# EAGLE design cable-adapter-12 (EAGLE 6.5.0)
DESIGNER: JONNEW, MWL@MIT; DESIGN_NAME: Cable adapter 24; LICENSE: (C) Jon Newman CC BY-SA-NC 4.0
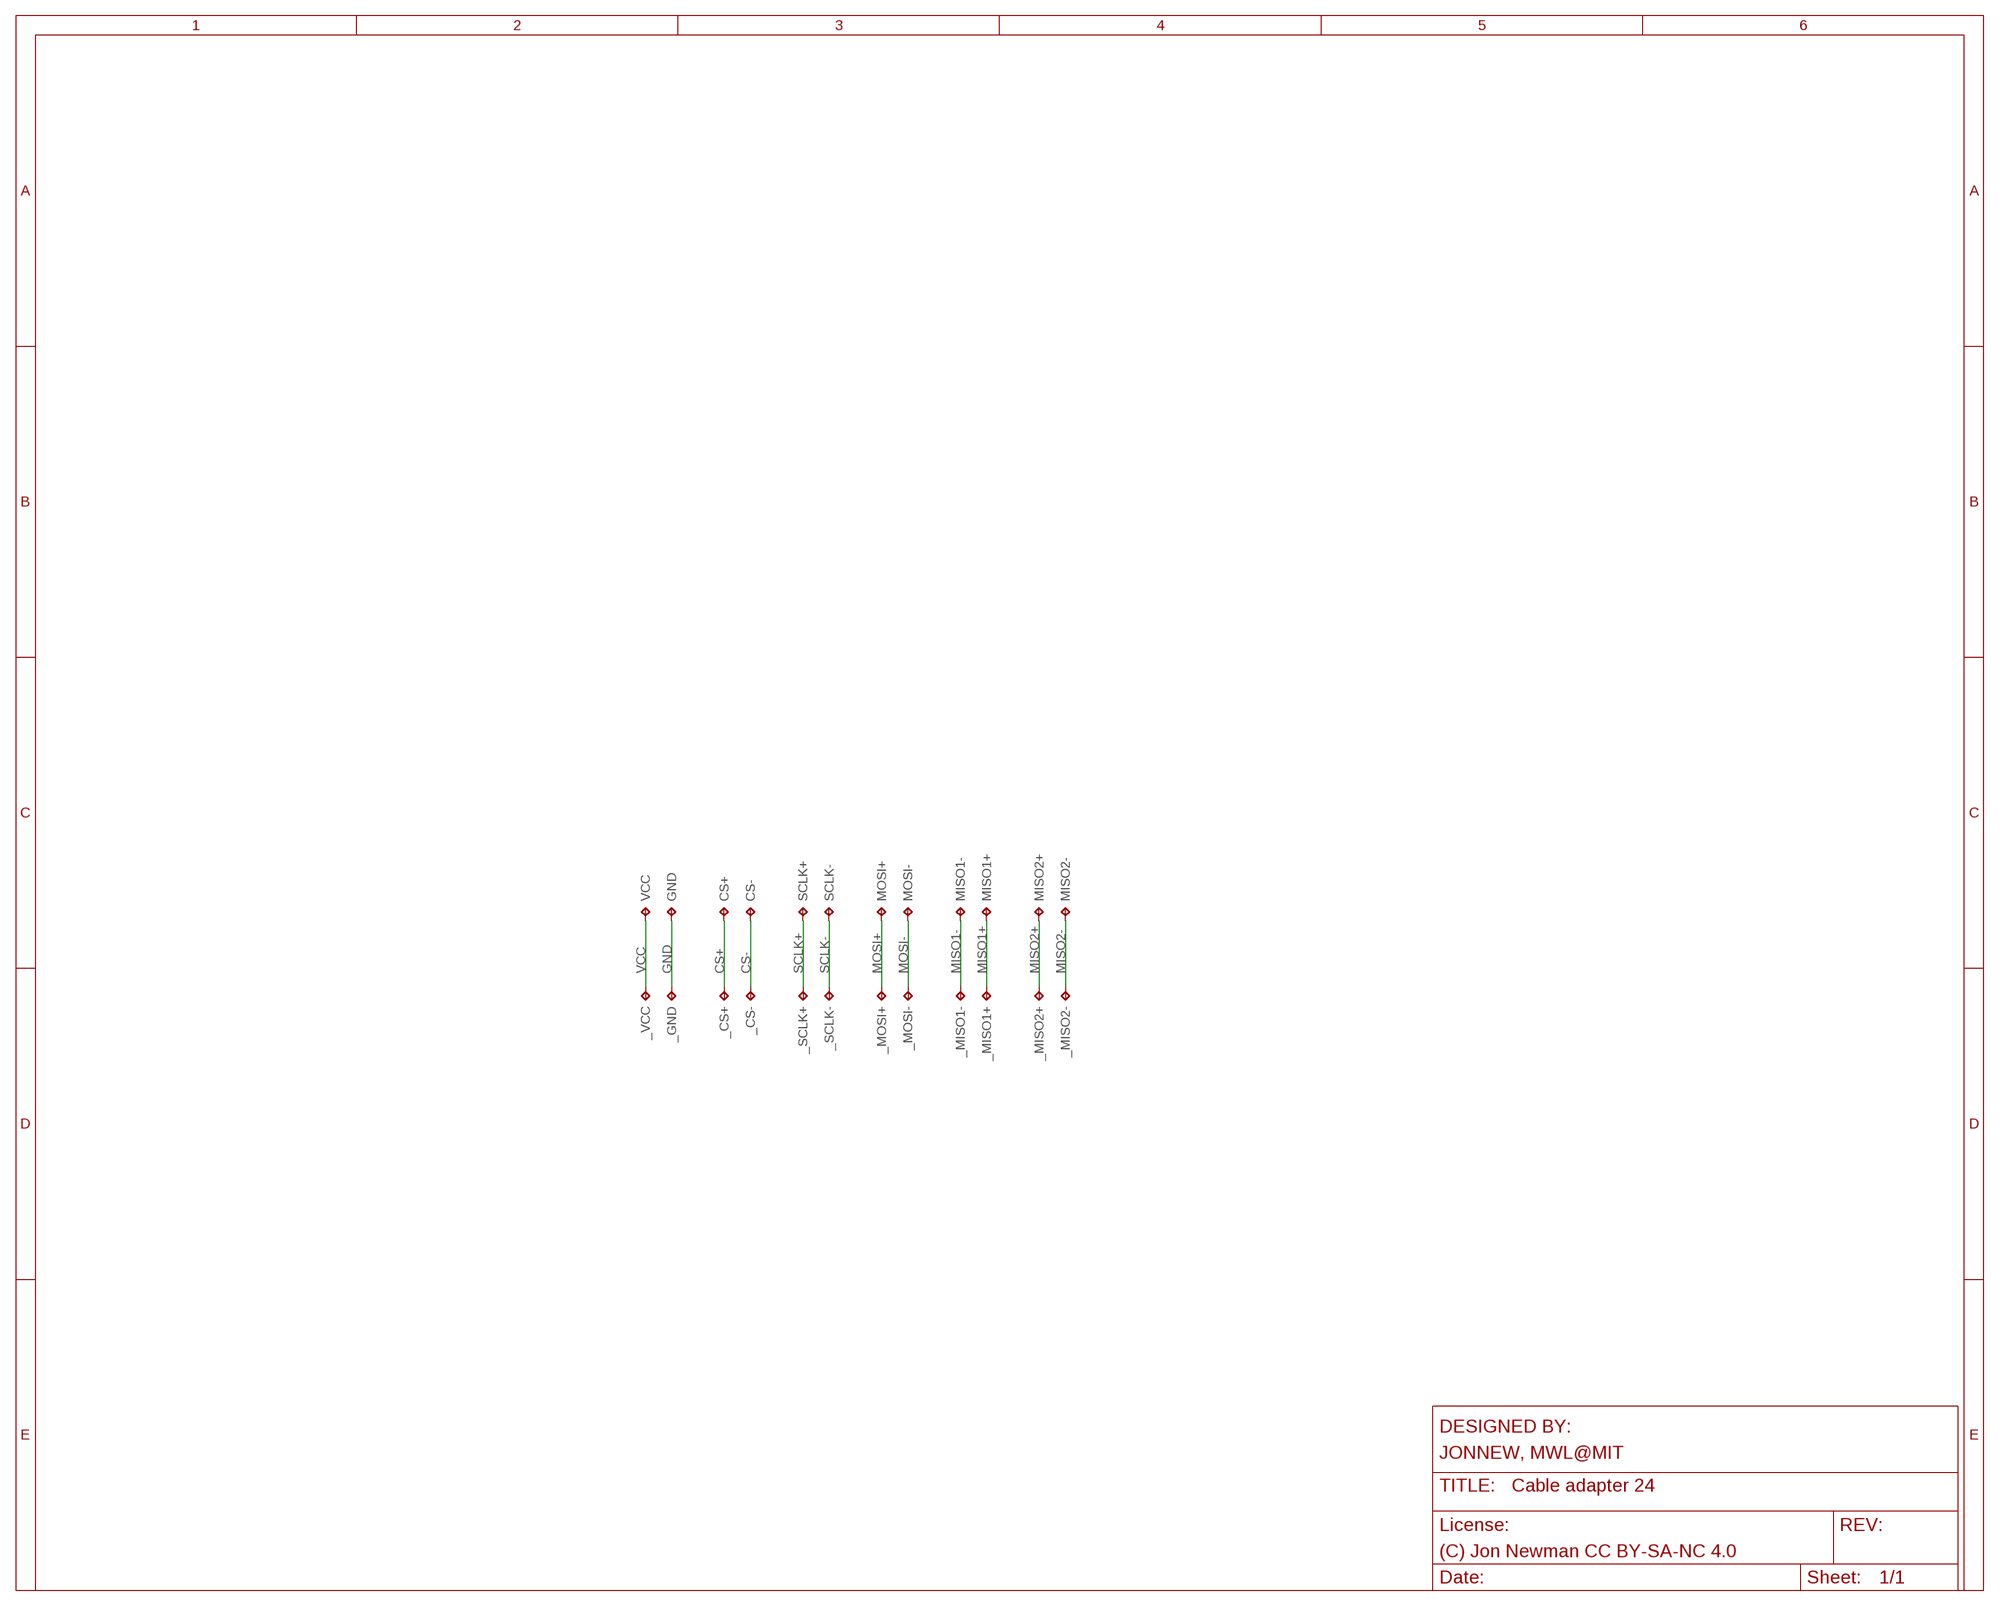
[diagram p0: schematic, sheet 1]

## Parts
_CS+  TP_SPI_WIRE+  [SPI_WIRE+]
_CS-  TP_SPI_WIRE+  [SPI_WIRE+]
_GND  TP_SPI_WIRE+  [SPI_WIRE+]
_MISO1+  TP_SPI_WIRE+  [SPI_WIRE+]
_MISO1-  TP_SPI_WIRE+  [SPI_WIRE+]
_MISO2+  TP_SPI_WIRE+  [SPI_WIRE+]
_MISO2-  TP_SPI_WIRE+  [SPI_WIRE+]
_MOSI+  TP_SPI_WIRE+  [SPI_WIRE+]
_MOSI-  TP_SPI_WIRE+  [SPI_WIRE+]
_SCLK+  TP_SPI_WIRE+  [SPI_WIRE+]
_SCLK-  TP_SPI_WIRE+  [SPI_WIRE+]
_VCC  TP_SPI_WIRE+  [SPI_WIRE+]
CS+  TP_SPI_WIRE+  [SPI_WIRE+]
CS-  TP_SPI_WIRE+  [SPI_WIRE+]
GND  TP_SPI_WIRE+  [SPI_WIRE+]
MISO1+  TP_SPI_WIRE+  [SPI_WIRE+]
MISO1-  TP_SPI_WIRE+  [SPI_WIRE+]
MISO2+  TP_SPI_WIRE+  [SPI_WIRE+]
MISO2-  TP_SPI_WIRE+  [SPI_WIRE+]
MOSI+  TP_SPI_WIRE+  [SPI_WIRE+]
MOSI-  TP_SPI_WIRE+  [SPI_WIRE+]
SCLK+  TP_SPI_WIRE+  [SPI_WIRE+]
SCLK-  TP_SPI_WIRE+  [SPI_WIRE+]
VCC  TP_SPI_WIRE+  [SPI_WIRE+]

## Nets
CS+: _CS+.P$1(TP) CS+.P$1(TP)
CS-: _CS-.P$1(TP) CS-.P$1(TP)
GND: _GND.P$1(TP) GND.P$1(TP)
MISO1+: _MISO1+.P$1(TP) MISO1+.P$1(TP)
MISO1-: _MISO1-.P$1(TP) MISO1-.P$1(TP)
MISO2+: _MISO2+.P$1(TP) MISO2+.P$1(TP)
MISO2-: _MISO2-.P$1(TP) MISO2-.P$1(TP)
MOSI+: _MOSI+.P$1(TP) MOSI+.P$1(TP)
MOSI-: _MOSI-.P$1(TP) MOSI-.P$1(TP)
SCLK+: _SCLK+.P$1(TP) SCLK+.P$1(TP)
SCLK-: _SCLK-.P$1(TP) SCLK-.P$1(TP)
VCC: _VCC.P$1(TP) VCC.P$1(TP)

## Library data of the parts
_CS+ _CS- _GND _MISO1+ _MISO1- _MISO2+ _MISO2- _MOSI+ _MOSI- _SCLK+ _SCLK- _VCC CS+ CS- GND MISO1+ MISO1- MISO2+ MISO2- MOSI+ MOSI- SCLK+ SCLK- VCC = jonnew:TP: Test pad

## Board
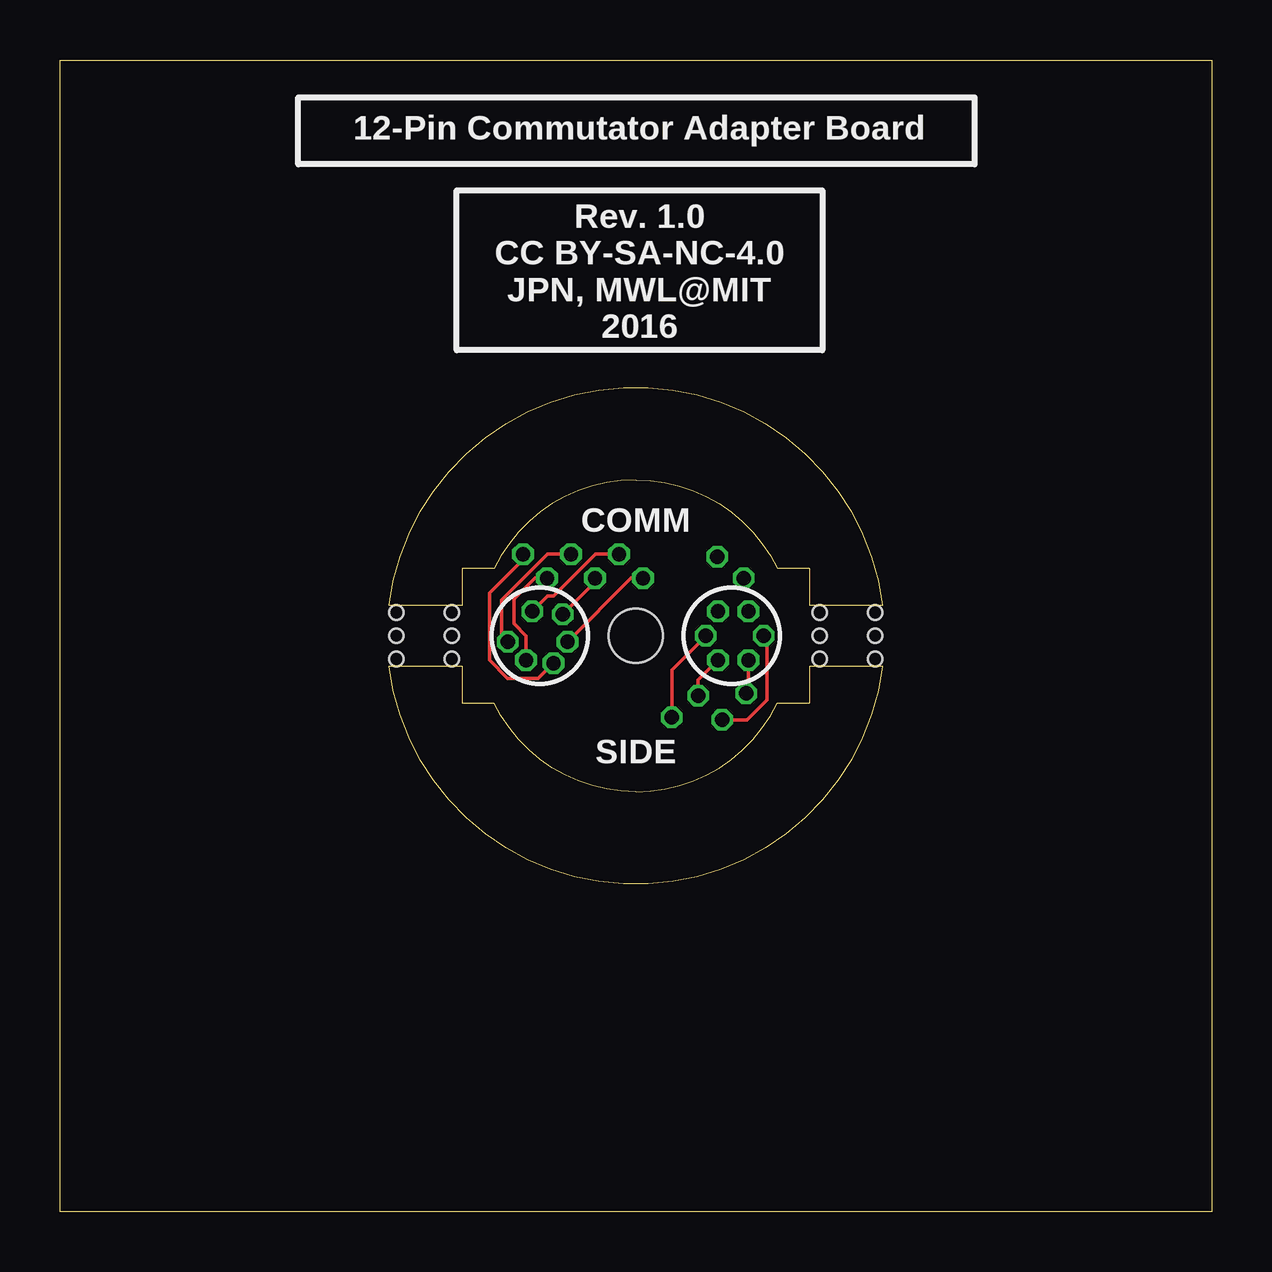
[diagram p1: board, top side]
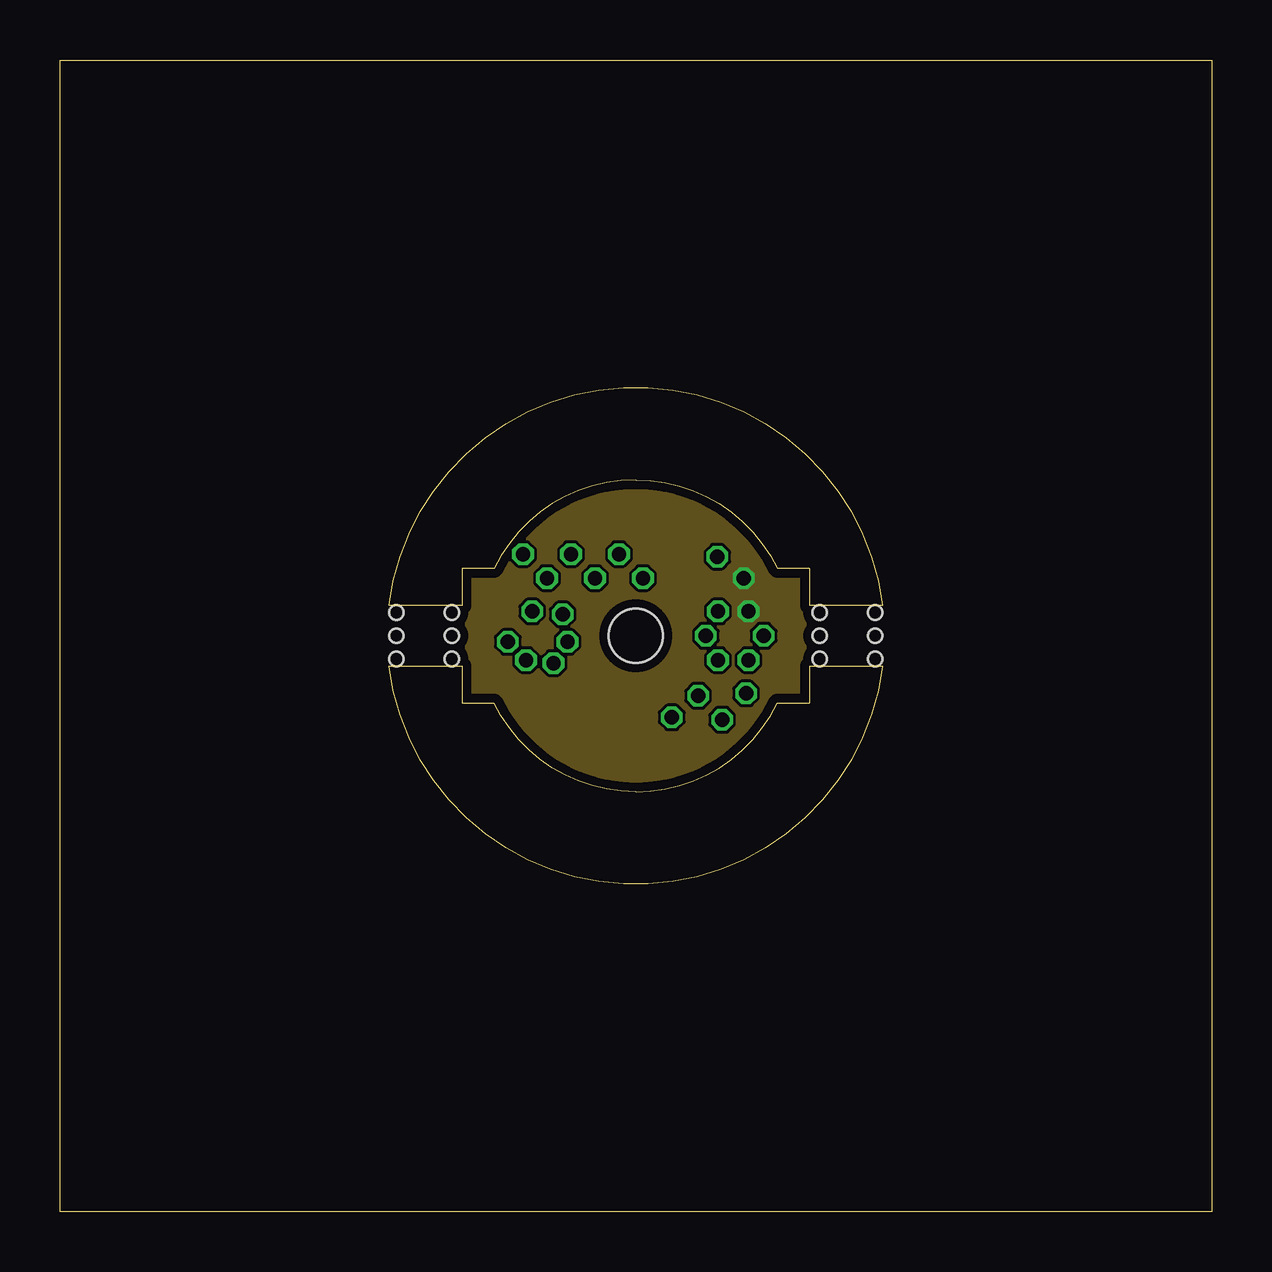
[diagram p2: board, inner layer Route2]
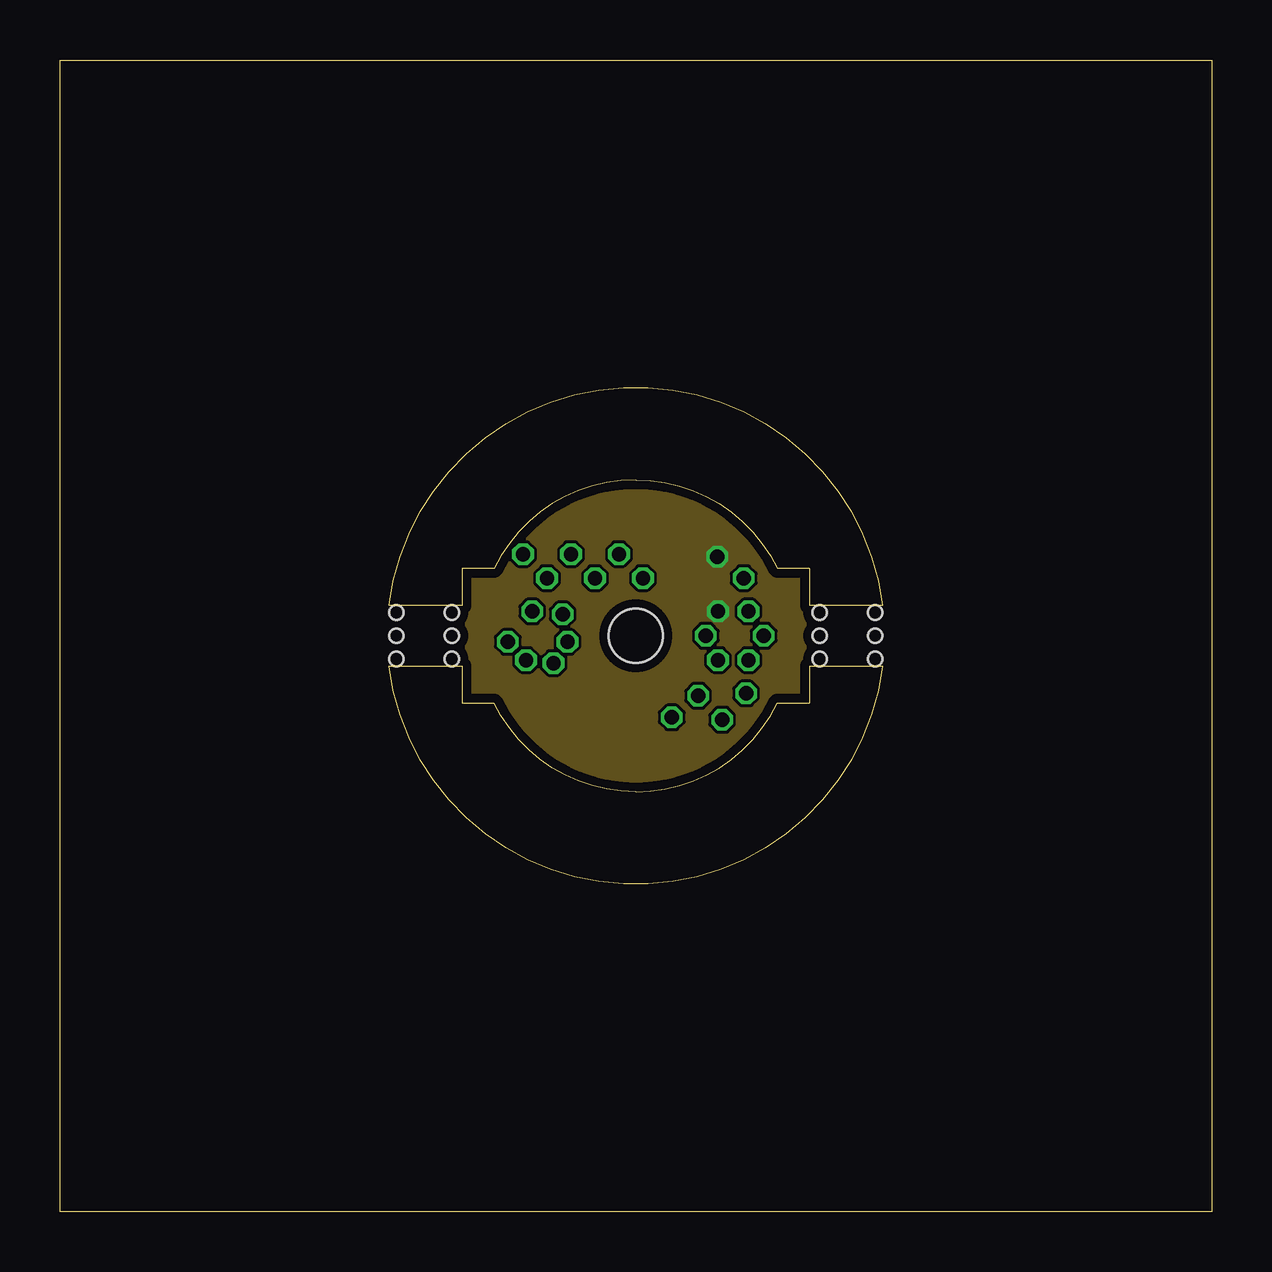
[diagram p3: board, inner layer Route15]
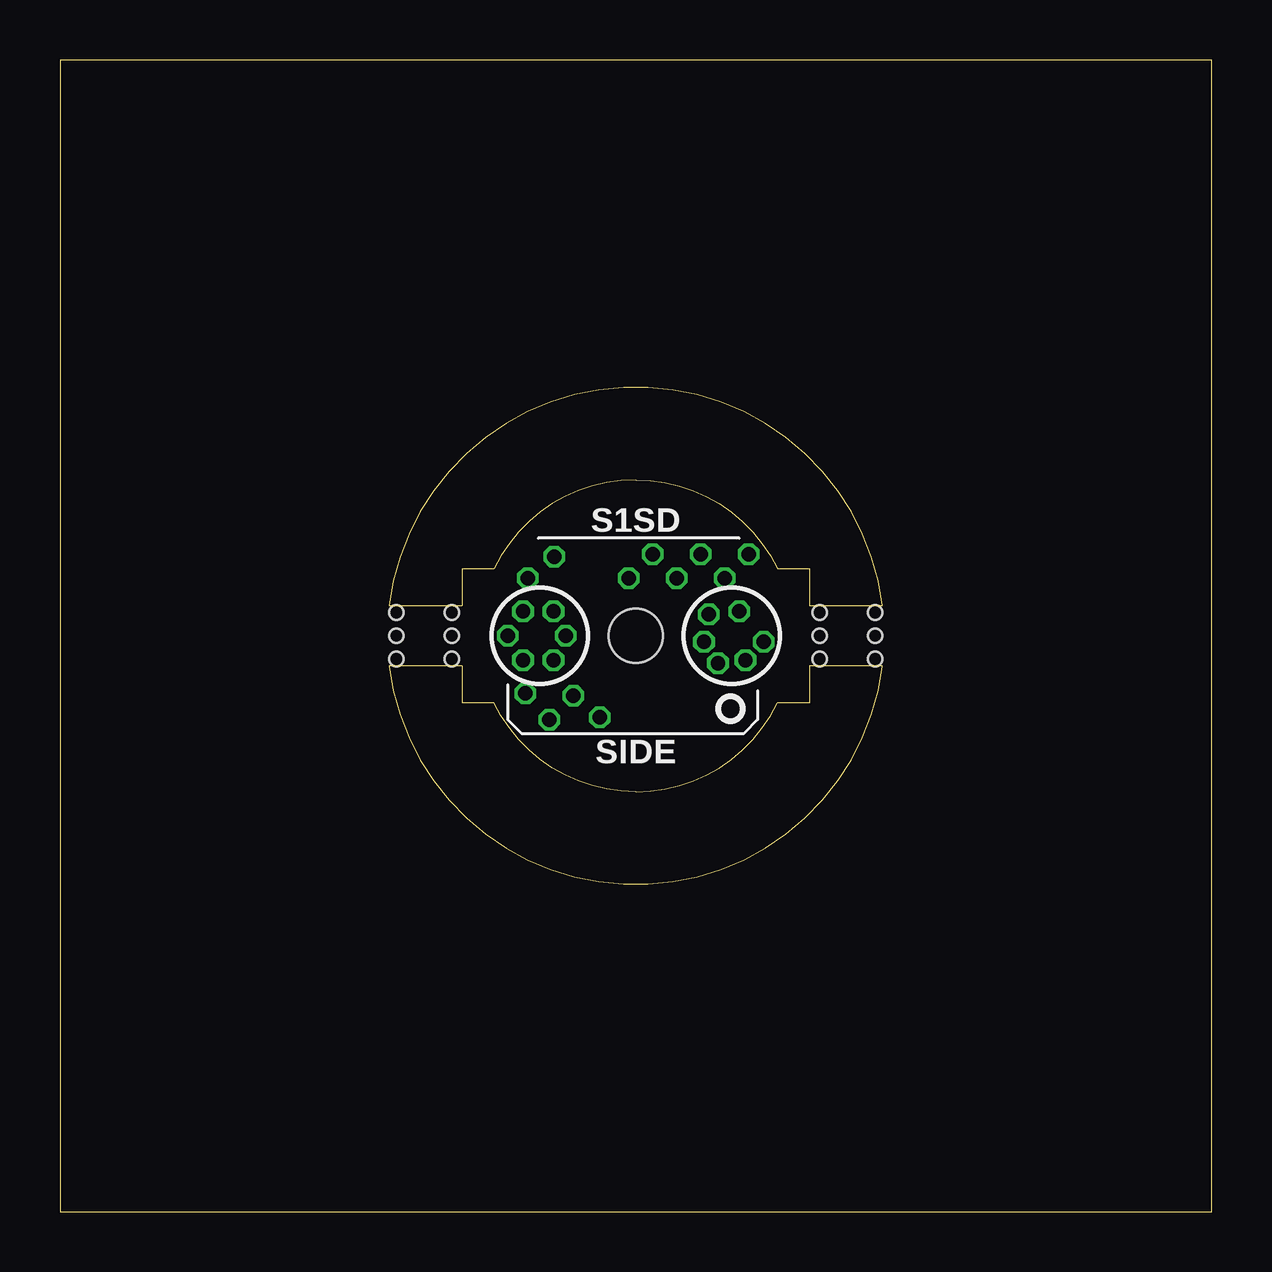
[diagram p4: board, bottom side, seen from below]

Size 48 x 48 mm. Coordinates in mm from the lower left corner, seen from the top.
Outline: 0,0 0,48 48,48 48,0 0,0
Outline: 13.71,22.73 16.76,22.73 16.76,21.21 18.1,21.2 arc65 24,17.5 arc65 29.9,21.2 31.24,21.21 31.24,22.73 34.29,22.73 arc-166 13.71,22.73
Outline: 16.76,25.27 13.71,25.27 arc-166 34.29,25.27 31.24,25.27 31.24,26.79 29.9,26.8 arc65 24,30.5 arc65 18.1,26.8 16.76,26.79 16.76,25.27
Copper layers (1*2*15*16): Top 0.035559375mm / dielectric 0.17018125mm / Route2 0.01778125mm / dielectric 47mil / Route15 0.01778125mm / dielectric 0.17018125mm / Bottom 0.035559375mm
Design rules "ohs-park-4-layer": minimum track width 5mil, minimum drill 10mil, track to track 5mil, track to pad 5mil, pad to pad 5mil, via to via 5mil, smd to smd 5mil, copper to edge 15mil, drill to drill 5mil, minimum pad ring 4mil, minimum via ring 4mil, stop-mask expansion 4mil, vias tented up to drill 100mil, thermal gap 10mil
Holes 2.26 mm at 24,24
Holes 0.6 mm at 16.33,24.97 16.33,24 16.33,23.03 14.02,24.97 14.02,24 14.02,23.03 31.67,23.03 31.67,24 31.67,24.97 33.98,23.03 33.98,24 33.98,24.97

### Footprints (pad centres in the part's own frame; a part is rotated, then mirrored left to right if it is on the bottom)
SPI_WIRE+ = drill 0.6 octagon: P$1 0,0

### Placement (x,y rotation side)
_CS+  20.57,22.86 0 top
_CS-  19.43,22.98 0 top
_GND  28.7,25.02 0 top
_MISO1+  27.43,22.98 0 top
_MISO1-  26.92,24 0 top
_MISO2+  28.7,22.98 0 top
_MISO2-  29.33,24 0 top
_MOSI+  19.68,25.02 0 top
_MOSI-  21.16,23.75 0 top
_SCLK+  18.67,23.75 0 top
_SCLK-  20.95,24.89 0 top
_VCC  27.43,25.02 0 top
CS+  19.3,27.4 0 top
CS-  20.3,26.4 0 top
GND  28.5,26.4 0 top
MISO1+  26.6,21.5 0 top
MISO1-  25.5,20.6 0 top
MISO2+  28.6,21.6 0 top
MISO2-  27.6,20.5 0 top
MOSI+  23.3,27.4 0 top
MOSI-  24.3,26.4 0 top
SCLK+  21.3,27.4 0 top
SCLK-  22.3,26.4 0 top
VCC  27.4,27.3 0 top

### Tracks (layer width: path | path; a pad name or v marks a point on that pad's centre or on a via)
CS+
  Top 0.152: CS+.P$1 19.3,27.17 17.9,25.78 17.9,22.98 18.67,22.22 19.94,22.22 _CS+.P$1
CS-
  Top 0.152: _CS-.P$1 19.43,24 18.92,24.51 18.92,25.52 19.8,26.4 CS-.P$1
GND
  pour Route2 (no thermals): -6.48,54.48 54.48,54.48 54.48,-9.02 -6.48,-9.02
MISO1+
  Top 0.152: MISO1+.P$1 26.6,22.16 _MISO1+.P$1
MISO1-
  Top 0.152: MISO1-.P$1 25.5,22.58 _MISO1-.P$1
MISO2+
  Top 0.152: MISO2+.P$1 28.7,21.7 _MISO2+.P$1
MISO2-
  Top 0.152: MISO2-.P$1 28.63,20.5 29.46,21.33 29.46,23.87 _MISO2-.P$1
MOSI+
  Top 0.152: MOSI+.P$1 22.32,27.4 21.59,26.67 20.57,25.65 20.32,25.65 _MOSI+.P$1
MOSI-
  Top 0.152: MOSI-.P$1 23.81,26.4 _MOSI-.P$1
SCLK+
  Top 0.152: _SCLK+.P$1 18.41,24 18.41,25.48 20.33,27.4 SCLK+.P$1
SCLK-
  Top 0.152: _SCLK-.P$1 22.3,26.24 SCLK-.P$1
VCC
  pour Route15 (no thermals): -3.94,51.94 -3.94,-6.48 51.94,-6.48 51.94,51.94

### Text on the board
tPlace: 12-Pin Commutator Adapter Board | Rev. 1.0 / CC BY-SA-NC-4.0 / JPN, MWL@MIT / 2016 | COMM | SIDE
bPlace: S1SD | SIDE